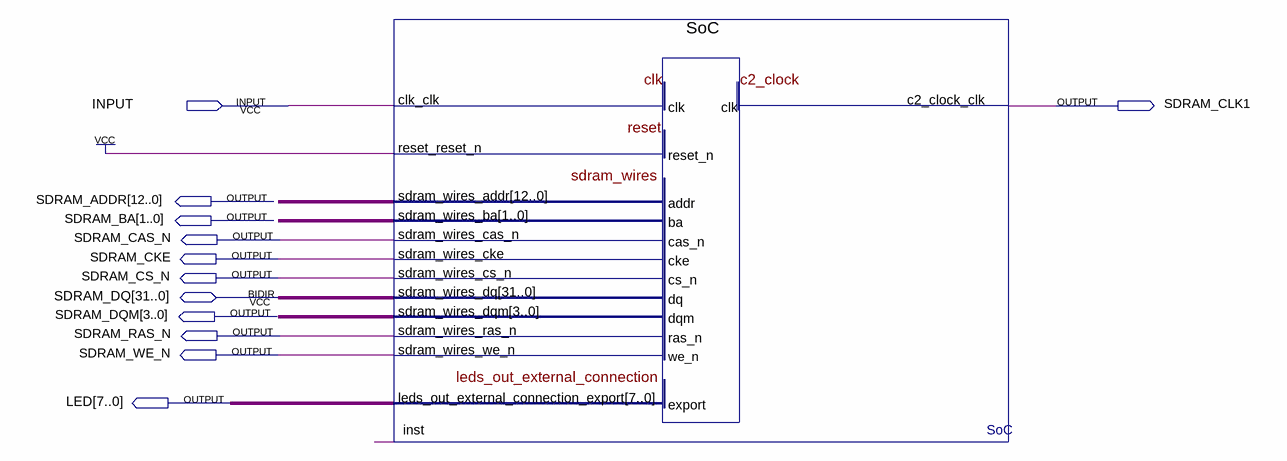
[diagram p0: schematic sheet]
// Quartus schematic crc_customization.bdf as structural Verilog: 1 symbols, 12 pins
module crc_customization (
  input  INPUT,
  inout  [31:0] SDRAM_DQ,
  output SDRAM_CLK1,
  output [12:0] SDRAM_ADDR,
  output [1:0] SDRAM_BA,
  output SDRAM_CAS_N,
  output SDRAM_CKE,
  output SDRAM_CS_N,
  output [3:0] SDRAM_DQM,
  output SDRAM_RAS_N,
  output SDRAM_WE_N,
  output [7:0] LED
);

  SoC inst (
    .clk_clk(INPUT), .reset_reset_n(1'b1), .sdram_wires_addr(SDRAM_ADDR), .sdram_wires_ba(SDRAM_BA),
    .sdram_wires_cas_n(SDRAM_CAS_N), .sdram_wires_cke(SDRAM_CKE), .sdram_wires_cs_n(SDRAM_CS_N),
    .sdram_wires_dqm(SDRAM_DQM), .sdram_wires_ras_n(SDRAM_RAS_N), .sdram_wires_we_n(SDRAM_WE_N),
    .c2_clock_clk(SDRAM_CLK1), .leds_out_external_connection_export(LED), .sdram_wires_dq(SDRAM_DQ));
endmodule
